# EAGLE design Sparkfun_AS6212_Qwiic (EAGLE 9.6.2)
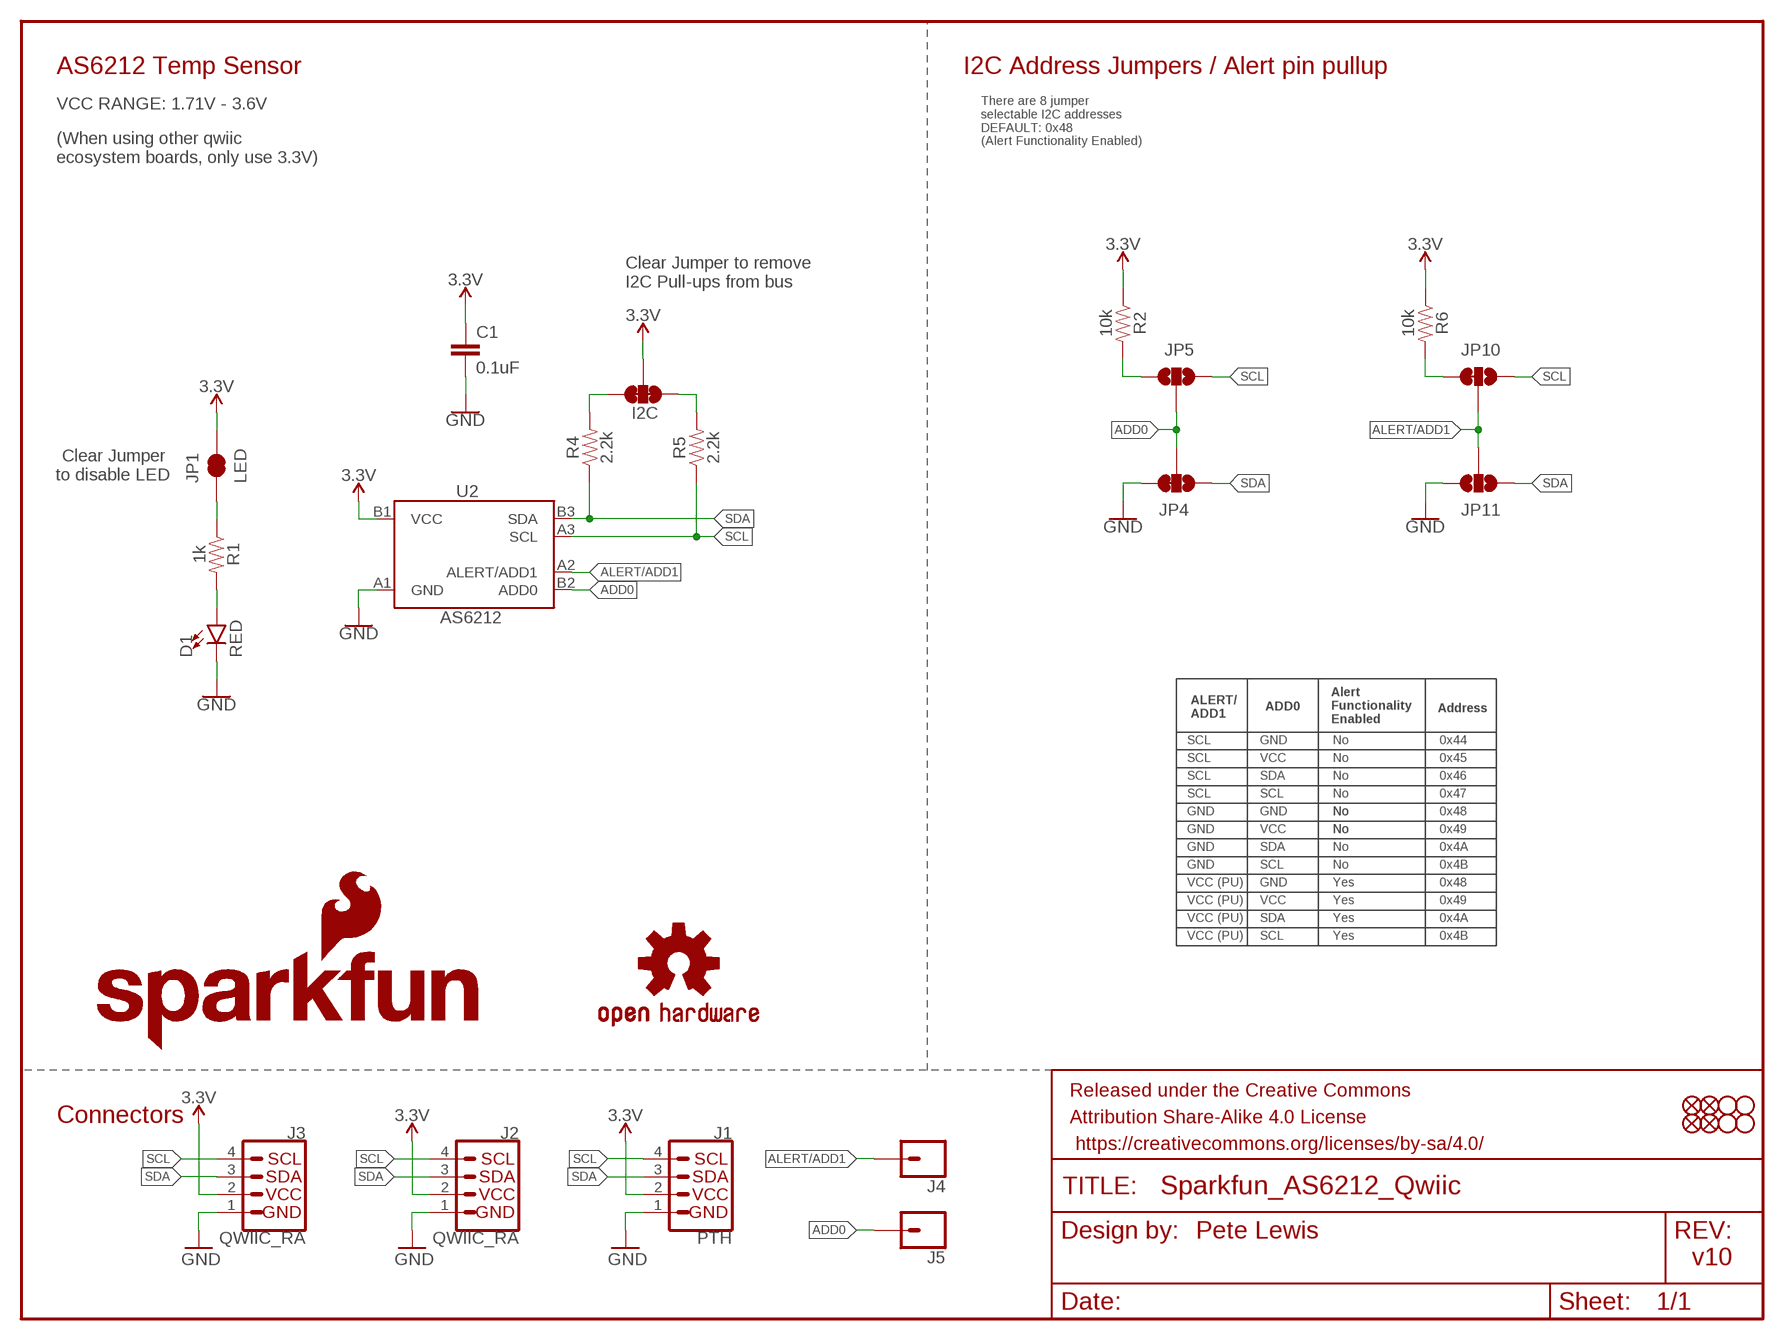
[diagram p0: schematic, sheet 1]

## Parts
C1  0.1uF  0.1UF-0603-25V-(+80/-20%)  [0603]
D1  RED  LED-RED0603  [LED-0603]
FD1  FIDUCIALUFIDUCIAL  [FIDUCIAL-MICRO]
FD2  FIDUCIALUFIDUCIAL  [FIDUCIAL-MICRO]
FD3  FIDUCIALUFIDUCIAL  [FIDUCIAL-MICRO]
FD4  FIDUCIALUFIDUCIAL  [FIDUCIAL-MICRO]
FRAME1  FRAME-LETTER  [CREATIVE_COMMONS]
I2C  JUMPER-SMT_3_2-NC_TRACE_SILK  [SMT-JUMPER_3_2-NC_TRACE_SILK]
J1  PTH  I2C_STANDARD_NO_SILK  [1X04_NO_SILK]
J2  QWIIC_RA  QWIIC_CONNECTORJS-1MM  [JST04_1MM_RA]
J3  QWIIC_RA  QWIIC_CONNECTORJS-1MM  [JST04_1MM_RA]
J4  CONN_01PTH_NO_SILK_YES_STOP  [1X01_NO_SILK]
J5  CONN_01PTH_NO_SILK_YES_STOP  [1X01_NO_SILK]
JP1  LED  JUMPER-SMT_2_NC_TRACE_SILK  [SMT-JUMPER_2_NC_TRACE_SILK]
JP2  STAND-OFF  [STAND-OFF]
JP3  STAND-OFF  [STAND-OFF]
JP4  JUMPER-SMT_3_1-NC_TRACE_NO-SILK  [SMT-JUMPER_3_1-NC_TRACE_NO-SILK]
JP5  JUMPER-SMT_3_NO_NO_SILK  [SMT-JUMPER_3_0-NO_TRACE_NO-SILK]
JP8  STAND-OFF  [STAND-OFF]
JP9  STAND-OFF  [STAND-OFF]
JP10  JUMPER-SMT_3_1-NC_TRACE_NO-SILK  [SMT-JUMPER_3_1-NC_TRACE_NO-SILK]
JP11  JUMPER-SMT_3_NO_NO_SILK  [SMT-JUMPER_3_0-NO_TRACE_NO-SILK]
LOGO1  OSHW-LOGOMINI  [OSHW-LOGO-MINI]
LOGO4  SFE_LOGO_NAME_FLAME.1_INCH  [SFE_LOGO_NAME_FLAME_.1]
R1  1k  1KOHM-0603-1/10W-1%  [0603]
R2  10k  10KOHM-0603-1/10W-1%  [0603]
R4  2.2k  2.2KOHM-0603-1/10W-1%  [0603]
R5  2.2k  2.2KOHM-0603-1/10W-1%  [0603]
R6  10k  10KOHM-0603-1/10W-1%  [0603]
U2  AS6212  AS6212WLCSP  [WLCSP]

## Nets
3.3V: C1.1 I2C.2 J1.2 J2.2 J3.2 JP1.2 R2.1 R6.1 U2.B1(VCC)
ADD0: J5.1 JP4.2 JP5.2 U2.B2(ADD0)
ALERT/ADD1: J4.1 JP10.2 JP11.2 U2.A2(ALERT/ADD1)
GND: C1.2 D1.C J1.1 J2.1 J3.1 JP4.3 JP11.3 U2.A1(GND)
N$1: D1.A R1.2
N$2: I2C.1 R5.2
N$3: I2C.3 R4.2
N$5: JP10.3 R6.2
N$7: JP5.1 R2.2
N$8: JP1.1 R1.1
SCL: J1.4 J2.4 J3.4 JP5.3 JP10.1 R5.1 U2.A3(SCL)
SDA: J1.3 J2.3 J3.3 JP4.1 JP11.1 R4.1 U2.B3(SDA)

## Notes on the sheet
- AS6212 Temp Sensor | I2C Address Jumpers / Alert pin pullup
- VCC RANGE: 1.71V - 3.6V
- There are 8 jumper 
  selectable I2C addresses
  DEFAULT: 0x48
  (Alert Functionality Enabled)
- (When using other qwiic 
  ecosystem boards, only use 3.3V)
- Clear Jumper to remove 
  I2C Pull-ups from bus
- Clear Jumper 
  to disable LED
- ADD0 | Address
- ALERT/
  ADD1
- Alert
  Functionality
  Enabled
- SCL | GND | No | 0x44
- SCL | VCC | No | 0x45
- SCL | SDA | No | 0x46
- SCL | SCL | No | 0x47
- GND | GND | No | No | 0x48
- GND | VCC | No | No | 0x49
- GND | SDA | No | 0x4A
- GND | SCL | No | 0x4B
- VCC (PU) | GND | Yes | 0x48
- VCC (PU) | VCC | Yes | 0x49
- VCC (PU) | SDA | Yes | 0x4A
- VCC (PU) | SCL | Yes | 0x4B
- Connectors
- Pete Lewis
- v10

## Library data of the parts
C1 = SparkFun-Capacitors:0.1UF: 0.1µF ceramic capacitors A capacitor is a passive two-terminal electrical component used to store electrical energy temporarily in an electric field.; PROD_ID: CAP-00810
D1 = SparkFun-LED:LED-RED: Red SMD LED Used in manufacturing of most products at SparkFun Packages: 0603 - SMD 0603 package [Product Link] <http://docs.avagotech.com/docs/AV02-0551EN> 0603 SMART - SMD 0603 SMART package ( more efficient and expensive)[Product Link] <http://www.osram-os.com/Graphics/XPic2/00077099_0.pdf> 1206 - SMD1206 package [Product Link] <https://www.sparkfun.com/datasheets/DevTools/LilyPad/Q150OVS4.pdff> SparkFun Products: Pro Mini 328 -5V <https://www.sparkfun.com/products/821> RedBoard <https://www.sparkfun.com/products/12757> IOIO-OTG <https://www.sparkfun.com/products/13613>; PROD_ID: DIO-00819
FD1-FD4 = SparkFun-Aesthetics:FIDUCIAL: Fiducial Alignment Points Point-of-reference for pick-and-place machines and other optical instruments.
FRAME1 = SparkFun-Aesthetics:FRAME-LETTER: Schematic Frame - Letter Standard 8.5x11 US Letter frame
I2C = SparkFun-Jumpers:JUMPER-SMT_3_2-NC_TRACE: Normally closed trace jumper (2 of 2 connections) This jumper has a trace between all three pads so they are normally closed (NC). Use a razor knife to open the connection(s). For best results follow the IPC guidelines for cutting traces: Cutout at least 0.063 mm (0.005 in). Remove all loose material to clean up the cut area. Seal the cut with an approved epoxy. Reapply solder to reclose the connection(s).
J1 = SparkFun-Connectors:I2C_STANDARD: SparkFun I2C Standard Pinout Header SparkFun has standardized on a pinout for all I2C based sensor breakouts. This pinout allows I2C boards to be plugged directly into the headers on Arduino Uno compatible boards, and to be daisy chained easily. Example SparkFun Products: SparkFun Atmospheric Sensor Breakout - BME280 <https://www.sparkfun.com/products/13676> SparkFun Altitude/Pressure Sensor Breakout - MPL3115A2 <https://www.sparkfun.com/products/11084> SparkFun TOF Range Finder Sensor - VL6180 <https://www.sparkfun.com/products/12785>
J2 J3 = SparkFun-Connectors:QWIIC_CONNECTOR: SparkFun I2C Standard Qwiic Connector An SMD 1mm pitch JST connector makes it easy and quick (get it? Qwiic?) to connect I2C devices to each other. The Qwiic system <http://www.sparkfun.com/qwiic> enables fast and solderless connection between popular platforms and various sensors and actuators. We carry 200mm <https://www.sparkfun.com/products/14204>, 100mm <https://www.sparkfun.com/products/14205>, 50mm <https://www.sparkfun.com/products/14206>, and breadboard friendly <https://www.sparkfun.com/products/14207> Qwiic cables. We also offer 10 pcs strips <https://www.sparkfun.com/products/14323> the SMD connectors.; PROD_ID: CONN-13694; VALUE: QWIIC_RIGHT_ANGLE
J4 J5 = SparkFun-Connectors:CONN_01: Single connection point. Often used as Generic Header-pin footprint for 0.1 inch spaced/style header connections On any of the 0.1 inch spaced packages, you can populate with these: Break Away Headers - Straight <https://www.sparkfun.com/products/116> (PRT-00116) Break Away Male Headers - Right Angle <https://www.sparkfun.com/products/553> (PRT-00553) Female Headers <https://www.sparkfun.com/products/115> (PRT-00115) Break Away Headers - Machine Pin <https://www.sparkfun.com/products/117> (PRT-00117) Break Away Female Headers - Swiss Machine Pin <https://www.sparkfun.com/products/743> (PRT-00743) This device is also useful as a general connection point to wire up your design to another part of your project. Our various solder wires solder well into these plated through hole pads. Hook-Up Wire - Assortment (Stranded, 22 AWG) <https://www.sparkfun.com/products/11375> (PRT-11375) Hook-Up Wire - Assortment (Solid Core, 22 AWG) <https://www.sparkfun.com/products/11367> (PRT-11367) View the entire wire category on our website here <https://www.sparkfun.com/categories/141> Special notes: SMTSO-256-ET is a "flush mount" nut for a 4-40 screw. We mostly use this on specialty testbeds; it is a nice way to connect hardware to your PCB at an adjustable hieght. Also note, the SNAP packages are for using a snappable style connector. We sell a baggie of snaps and they are also used on two LilyPad designs: Snap Assortment - 30 pack (male and female) <https://www.sparkfun.com/products/11347> (DEV-11347) LilyPad Arduino SimpleSnap <https://www.sparkfun.com/products/10941> (DEV-10941) LilyPad SimpleSnap Protoboard <https://www.sparkfun.com/products/10940> (DEV-10940)
JP1 = SparkFun-Jumpers:JUMPER-SMT_2_NC_TRACE: Normally closed trace jumper This jumper has a trace between two pads so it's normally closed (NC). Use a razor knife to open the connection. For best results follow the IPC guidelines for cutting traces: Cutout at least 0.063 mm (0.005 in). Remove all loose material to clean up the cut area. Seal the cut with an approved epoxy. Reapply solder to reclose the connection.
JP2 JP3 JP8 JP9 = SparkFun-Hardware:STAND-OFF: Stand Off Drill holes for mechanically mounting via screws, standoffs, etc. Note: Use the keepout ring to avoid running the screw head into surrounding components. Variant Overviews STAND-OFF - Mechanical footprint for a #4 phillips button head screw. STAND-OFF-TIGHT - Mechanical footprint for a #4 phillips button head screw, Example SparkFun Products Screw - Phillips Head (1/4", 4-40, 10 pack) <https://www.sparkfun.com/products/10453> (PRT-10453) Screw - Phillips Head (1/2", 4-40, 10 pack) <https://www.sparkfun.com/products/10452> (PRT-10452) Screw - Phillips Head (3/4", 4-40, 10 pack) <https://www.sparkfun.com/products/10451> (PRT-10451) Screw - Phillips Head (1", 4-40, 10 pack) <https://www.sparkfun.com/products/10450> (PRT-10450)
JP4 JP10 = SparkFun-Jumpers:JUMPER-SMT_3_1-NC_TRACE: Normally closed trace jumper (1 of 2 connections) This jumper has a trace between two pads so it's normally closed (NC). The other connection is normally open (NO). Use a razor knife to open the connection. For best results follow the IPC guidelines for cutting traces: Cutout at least 0.063 mm (0.005 in). Remove all loose material to clean up the cut area. Seal the cut with an approved epoxy. Reapply solder to reclose the connection, or to close the NO connection.
JP5 JP11 = SparkFun-Jumpers:JUMPER-SMT_3_NO: Normally open jumper This jumper has three pads in close proximity to each other. Apply solder to close the connection(s).
LOGO1 = SparkFun-Aesthetics:OSHW-LOGO: Open-Source Hardware (OSHW) Logo This logo indicates the piece of hardware it is found on incorporates a OSHW license and/or adheres to the definition of open source hardware found here: http://freedomdefined.org/OSHW
LOGO4 = SparkFun-Aesthetics:SFE_LOGO_NAME_FLAME: SparkFun Font Logo w/ Flame This is the SparkFun full logo. The logo on the schematic will always be the same size; the package variant is the height of the flame part of the logo. Default layer for the logo on the board is tSilk.
R1 = SparkFun-Resistors:1KOHM: 1kΩ resistor A resistor is a passive two-terminal electrical component that implements electrical resistance as a circuit element. Resistors act to reduce current flow, and, at the same time, act to lower voltage levels within circuits. - Wikipedia; PROD_ID: RES-07856
R2 R6 = SparkFun-Resistors:10KOHM: 10kΩ resistor A resistor is a passive two-terminal electrical component that implements electrical resistance as a circuit element. Resistors act to reduce current flow, and, at the same time, act to lower voltage levels within circuits. - Wikipedia; PROD_ID: RES-00824
R4 R5 = SparkFun-Resistors:2.2KOHM: 2.2kΩ resistor A resistor is a passive two-terminal electrical component that implements electrical resistance as a circuit element. Resistors act to reduce current flow, and, at the same time, act to lower voltage levels within circuits. - Wikipedia; PROD_ID: RES-08272
U2 = as6212:AS6212: AMS AS6212 Low-Power Digital Temperature Sensor The AS621x IC family is a high accuracy temperature sensor system that communicates via a 2-wire digital bus with other devices. It consists of a Si bandgap temperature sensor, an ADC and a digital signal processor. Datasheet <https://ams.com/documents/20143/36005/AS621x_DS000677_2-00.pdf> SparkFun Products SparkFun Digital Temperature Sensor Breakout - AS6212 (Qwiic) <https://www.sparkfun.com/products/18521> (SEN-18521); PROD_ID: IC-16171

## Board
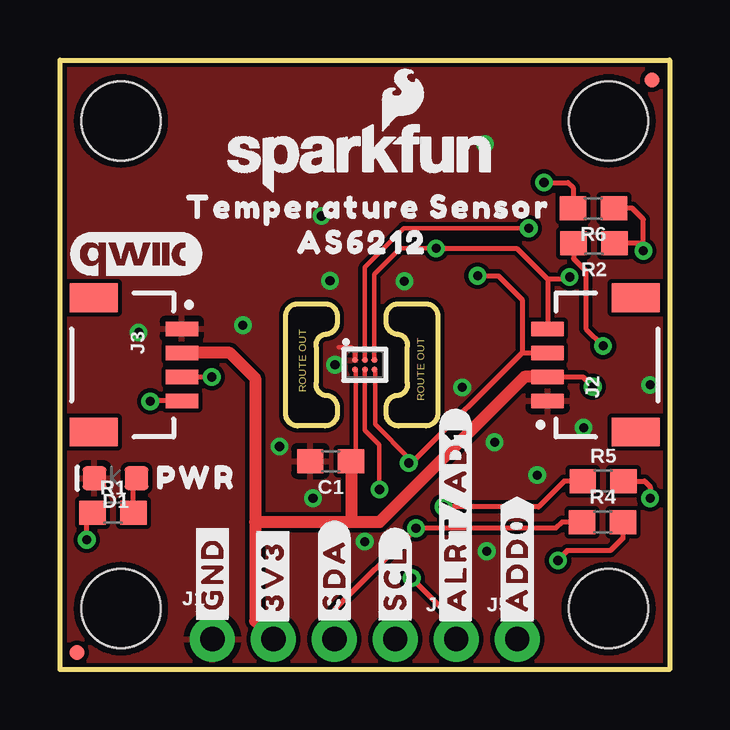
[diagram p1: board, top side]
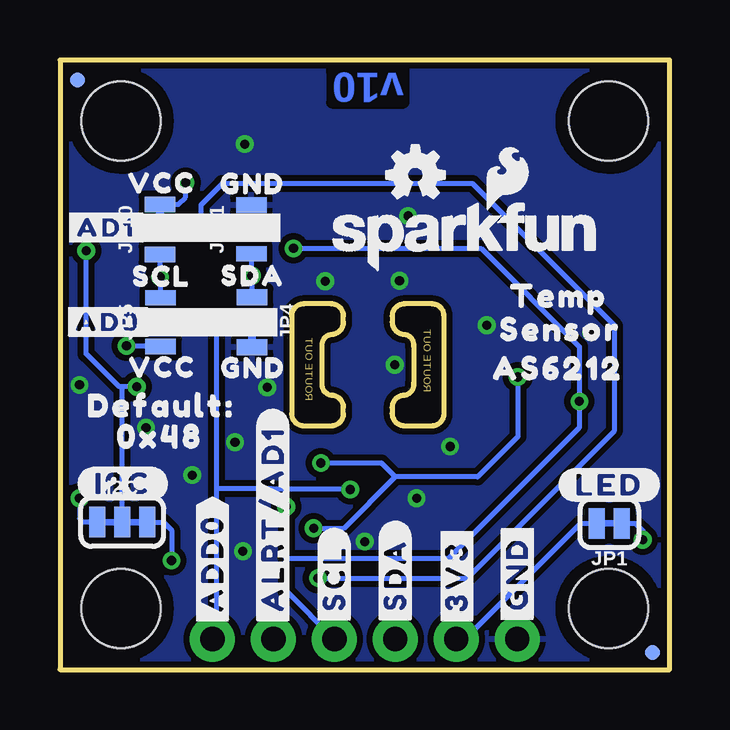
[diagram p2: board, bottom side, seen from below]

Size 25.4 x 25.4 mm. Coordinates in mm from the lower left corner, seen from the top.
Outline: 0,0 0,25.4 25.4,25.4 25.4,0 0,0
Outline: 11.56,14.73 11.56,14.48 arc-90 11.05,13.97 arc90 10.67,13.46 10.67,11.94 arc90 11.05,11.43 arc-90 11.56,10.92 11.56,10.67 arc-90 11.05,10.16 9.91,10.16 arc-90 9.4,10.67 9.4,14.73 arc-90 9.91,15.24 11.05,15.24 arc-90 11.56,14.73
Outline: 13.59,10.67 13.59,10.92 arc-90 14.1,11.43 arc90 14.48,11.94 14.48,13.46 arc90 14.1,13.97 arc-90 13.59,14.48 13.59,14.73 arc-90 14.1,15.24 15.24,15.24 arc-90 15.75,14.73 15.75,10.67 arc-90 15.24,10.16 14.1,10.16 arc-90 13.59,10.67
Copper layers (1*16): Top 0.035mm / dielectric 1.5mm / Bottom 0.035mm
Design rules "SparkFun-2-Layer-General-JLCPCB": minimum track width 7mil, minimum drill 0.3mm, track to track 7mil, track to pad 7mil, pad to pad 7mil, via to via 7mil, smd to smd 7mil, copper to edge 7mil, drill to drill 7mil, minimum pad ring 7mil, minimum via ring 7mil, stop-mask expansion 3mil, vias tented up to drill 25mil, thermal gap 10mil
tRestrict: area 11.9,12.9 to 12,13

### Footprints (pad centres in the part's own frame; a part is rotated, then mirrored left to right if it is on the bottom)
0603 = smd 1.1 x 1: 1 -0.85,0; 2 0.85,0
LED-0603 = smd 1 x 1: A -0.877,0; C 0.877,0
FIDUCIAL-MICRO = smd 0.635 x 0.635: 1 0,0
SMT-JUMPER_3_2-NC_TRACE_SILK = smd 0.66 x 1.27: 1 -1.041,0; 2 0,0; 3 1.041,0
1X04_NO_SILK = drill 1.016 pad 1.88: 1 0,0; 2 2.54,0; 3 5.08,0; 4 7.62,0
JST04_1MM_RA = smd 0.6 x 1.35: 1 -1.5,0; 2 -0.5,0; 3 0.5,0; 4 1.5,0 | smd 1.2 x 2: NC1 2.8,-3.675; NC2 -2.8,-3.675
1X01_NO_SILK = drill 1.016 pad 1.88: 1 0,0
SMT-JUMPER_2_NC_TRACE_SILK = smd 0.66 x 1.27: 1 -0.521,0; 2 0.521,0
STAND-OFF = hole 3.302: 0,0
SMT-JUMPER_3_1-NC_TRACE_NO-SILK = smd 0.66 x 1.27: 1 -1.041,0; 2 0,0; 3 1.041,0
SMT-JUMPER_3_0-NO_TRACE_NO-SILK = smd 0.635 x 1.27: 1 -1.016,0; 2 0,0; 3 1.016,0
WLCSP = smd 0.25 x 0.25: A1 -0.4,0.2; A2 0,0.2; A3 0.4,0.2; B1 -0.4,-0.2; B2 0,-0.2; B3 0.4,-0.2

### Placement (x,y rotation side)
C1  11.28,8.69 180 top
D1  2.31,7.98 180 top
FD1  0.71,0.71 0 top
FD2  24.66,24.56 0 top
FD3  24.66,24.56 0 bottom
FD4  0.71,0.71 0 bottom
FRAME1  -7.62,-19.05 0 top  (outside the outline)
I2C  22.81,6.15 0 bottom
J1  6.35,1.27 0 top
J2  20.32,12.7 90 top
J3  5.08,12.7 270 top
J4  16.51,1.27 0 top
J5  19.05,1.27 0 top
JP1  2.51,6.1 180 bottom
JP2  2.54,2.54 0 top
JP3  22.86,2.54 0 top
JP4  17.4,14.48 270 bottom
JP5  21.21,14.48 90 bottom
JP8  22.86,22.86 0 top
JP9  2.54,22.86 0 top
JP10  21.23,18.34 90 bottom
JP11  17.42,18.34 90 bottom
LOGO1  10.59,20.62 0 bottom
LOGO2  SFE_LOGO_NAME_FLAME.1_INCH  [SFE_LOGO_NAME_FLAME_.1]  8.48,18.06 0 bottom
LOGO4  12.55,21.34 0 top
R1  2.21,6.53 0 top
R2  22.25,17.75 180 top
R4  22.61,6.15 0 top
R5  22.63,7.85 0 top
R6  22.23,19.23 180 top
U2  12.7,12.7 0 top
U$1  [#LED#10]  2.51,7.7 0 bottom
U$2  [#I2C#11]  22.78,7.75 0 bottom
U$3  [AS62128]  4.65,12.55 0 bottom
U$4  [#AD0#1]  23.39,14.48 0 bottom
U$5  [#AD1#1]  23.47,18.41 0 bottom
U$6  [SCL3]  21.16,16.38 0 bottom
U$7  [VCC4]  21.16,20.27 0 bottom
U$8  [DEFAULT#11]  21.18,11 0 bottom
U$9  [GND5]  17.37,20.24 0 bottom
U$10  [SDA6]  17.35,16.41 0 bottom
U$11  [#ALRT#AD1#12]  16.54,6.27 90 bottom
U$12  [#ALRT#AD1#12]  16.48,6.27 90 top
U$13  [VCC4]  21.13,12.6 0 bottom
U$14  [GND5]  17.35,12.57 0 bottom
U$15  [QWIIC_5.5MM]  3.17,17.32 0 top
U$16  [SENSOR8]  4.55,14.17 0 bottom
U$17  [TEMP9]  4.62,15.57 0 bottom
U$18  [0X4812]  21.23,9.7 0 bottom
U$19  [PWR12]  5.66,8 0 top
U$20  [#3V3#13]  8.86,3.89 90 bottom
U$21  [#3V3#13]  8.86,3.89 90 top
U$24  [TEMPERATURE_SENSOR7]  12.85,19.28 0 top
U$25  [AS62128]  12.6,17.81 0 top
U$26  [#GND#62130]  6.35,3.99 90 top
U$28  [#SDA#62131]  11.43,3.96 90 top
U$29  [#SCL#62132]  13.97,3.81 90 top
U$30  [#GND#62130]  6.35,3.99 90 bottom
U$31  [#ADD0#0]  19.05,4.45 90 top
U$34  [#SDA#62131]  11.43,3.96 90 bottom
U$35  [#SCL#62132]  13.97,3.81 90 bottom
U$36  [#ADD0#0]  19.05,4.45 90 bottom

### Tracks (layer width: path | path; a pad name or v marks a point on that pad's centre or on a via)
3.3V  (via drill 0.38)
  Top 0.178: U2.B1 12.32,12.47 12.32,8.88 C1.1
  Top 0.203: J2.2 21.79,12.2 v22.2,11.79 | R6.1 23.84,19.23 24.31,18.76 24.31,17.78 | v24.31,17.45 24.31,17.78 | R2.1 23.13,17.78 24.31,17.78
  Top 0.508: J3.2 7.07,13.2 8.13,12.14 8.13,6.15 | J2.2 19.36,12.2 13.31,6.15 12.12,6.15 | J1.2 8.13,2.03 8.13,6.15 | 12.12,6.15 8.13,6.15 | C1.1 12.13,6.16 12.12,6.15
  Bottom 0.203: v22.2,11.79 22.81,11.79 | 22.81,11.79 22.94,11.79 24.31,13.16 v24.31,17.45 | I2C.2 22.81,11.79 | J1.2 8.53,1.27 3.71,6.1 JP1.2
ADD0  (via drill 0.38)
  Top 0.178: U2.B2 12.7,9.98 13.31,9.37 v13.31,7.51
  Bottom 0.203: JP5.2 18.87,14.48 | 18.87,14.48 JP4.2 | 18.87,7.49 18.87,14.48 | v13.31,7.51 13.34,7.53 16.51,7.53 16.57,7.53 18.83,7.53 18.87,7.49 | J5.1 18.87,1.45 18.87,7.49
ALERT/ADD1  (via drill 0.38)
  Top 0.178: U2.A2 12.7,16.76 14.33,18.39 v19.53,18.39
  Top 0.203: J4.1 16.51,1.96 v14.66,3.81
  Bottom 0.203: v19.53,18.39 20.97,18.39 20.99,18.36 21.21,18.36 JP10.2 | JP11.2 19.48,18.34 v19.53,18.39 | v14.66,3.81 8.43,3.81 2.29,9.96 2.29,14.33 8.2,20.24 18.64,20.24 19.53,19.36 v19.53,18.39
GND  (via drill 0.38)
  Top 0.178: U2.A1 12.3,13.28 12.14,13.44 11.61,13.44
  other vias: 11.46,12.7 21.82,10.08 16.76,11.76 10.9,18.9 17.7,21.89 24.59,11.86 7.62,14.35 3.28,14.05 19.89,8.1 14.35,16.18 11.25,16.21 10.54,7.14 12.7,5.33 18.11,9.47 17.78,4.93 9.14,9.3
  pour Top: 25.4,0 25.4,25.4 0,25.4 0,0
  pour Bottom (isolate 0.254): 25.4,0 25.4,25.4 0,25.4 0,0
N$1
  Top 0.203: R1.2 3.06,7.85 D1.A
N$2  (via drill 0.38)
  Top 0.203: R5.2 24.36,7.85 24.59,7.62 v24.59,7.14
  Bottom 0.203: v24.59,7.14 24.59,6.3 24.43,6.15 I2C.1
N$3  (via drill 0.38)
  Top 0.203: R4.2 23.46,5.47 22.94,4.95 21.13,4.95 20.75,4.57 v20.75,4.55
  Bottom 0.203: I2C.3 21.08,6.15 20.75,5.82 v20.75,4.55
N$5  (via drill 0.38)
  Top 0.203: v20.17,20.3 21.16,20.3 21.38,20.08 R6.2
  Bottom 0.203: JP10.3 20.47,19.38 20.17,19.68 v20.17,20.3
N$7  (via drill 0.38)
  Top 0.203: R2.2 21.4,17.12 21.91,16.61 21.91,14.21 v22.63,13.49
  Bottom 0.203: v22.63,13.49 21.23,13.49 JP5.1
N$8  (via drill 0.38)
  Top 0.203: v1.12,5.41 1.12,6.29 R1.1
  Bottom 0.203: JP1.1 1.42,6.1 1.12,5.79 v1.12,5.41
SCL  (via drill 0.38)
  Top 0.178: v15.67,17.55 14.17,17.55 13.1,16.48 U2.A3
  Top 0.203: v15.67,17.55 19.02,17.55 20.32,16.26 | 20.32,16.26 J2.4 | v21.23,16.36 21.13,16.26 20.32,16.26 | R5.1 21.01,7.85 19.94,6.78 v15.98,6.78 | J3.4 3.78,11.2 v3.76,11.18
  Bottom 0.203: JP5.3 21.21,16.33 v21.23,16.36 JP10.1 | v15.98,6.78 15.98,4.62 | 15.98,4.62 15.98,3.28 J1.4 | 15.98,4.62 9.22,4.62 3.76,10.08 v3.76,11.18 3.76,13.46 7.85,17.55 v15.67,17.55
SDA  (via drill 0.38)
  Top 0.178: U2.B3 13.12,12.47 13.12,10.22 14.53,8.81 v14.53,8.61
  Top 0.203: 19.25,13.2 J2.3 | v14.53,8.61 14.66,8.61 19.25,13.2 | v17.4,16.41 18.26,16.41 19.25,15.42 19.25,13.2 | R4.1 20.92,6.15 20.66,5.89 v14.83,5.89 11.43,2.49 J1.3 | J3.3 v6.32,12.2 v6.33,12.19
  Bottom 0.203: JP11.1 17.42,16.43 v17.4,16.41 JP4.1 | v14.83,5.89 13.56,5.89 11.43,8.03 | 11.43,8.03 8,8.03 6.33,9.7 v6.33,12.19 | v14.53,8.61 12.01,8.61 11.43,8.03

### Text on the board
Bottom: v10
Dimension: ROUTE OUT | ROUTE OUT
Measures: Measurement Units: INCHES
tDocu: Pete Lewis